# Altium schematic sheet pcb_tutorial.SchDoc: Wacky2023 XXX
size A3; DrawnBy: Heng Yin; Address1: ECE Department; Address2: University of Canterbury; Address3: Christchurch 8041; Address4: New Zealand; Revision: 1; ImagePath: \\maxwell\elecapp\AltiumDesigner\Templates\uc-logo.png
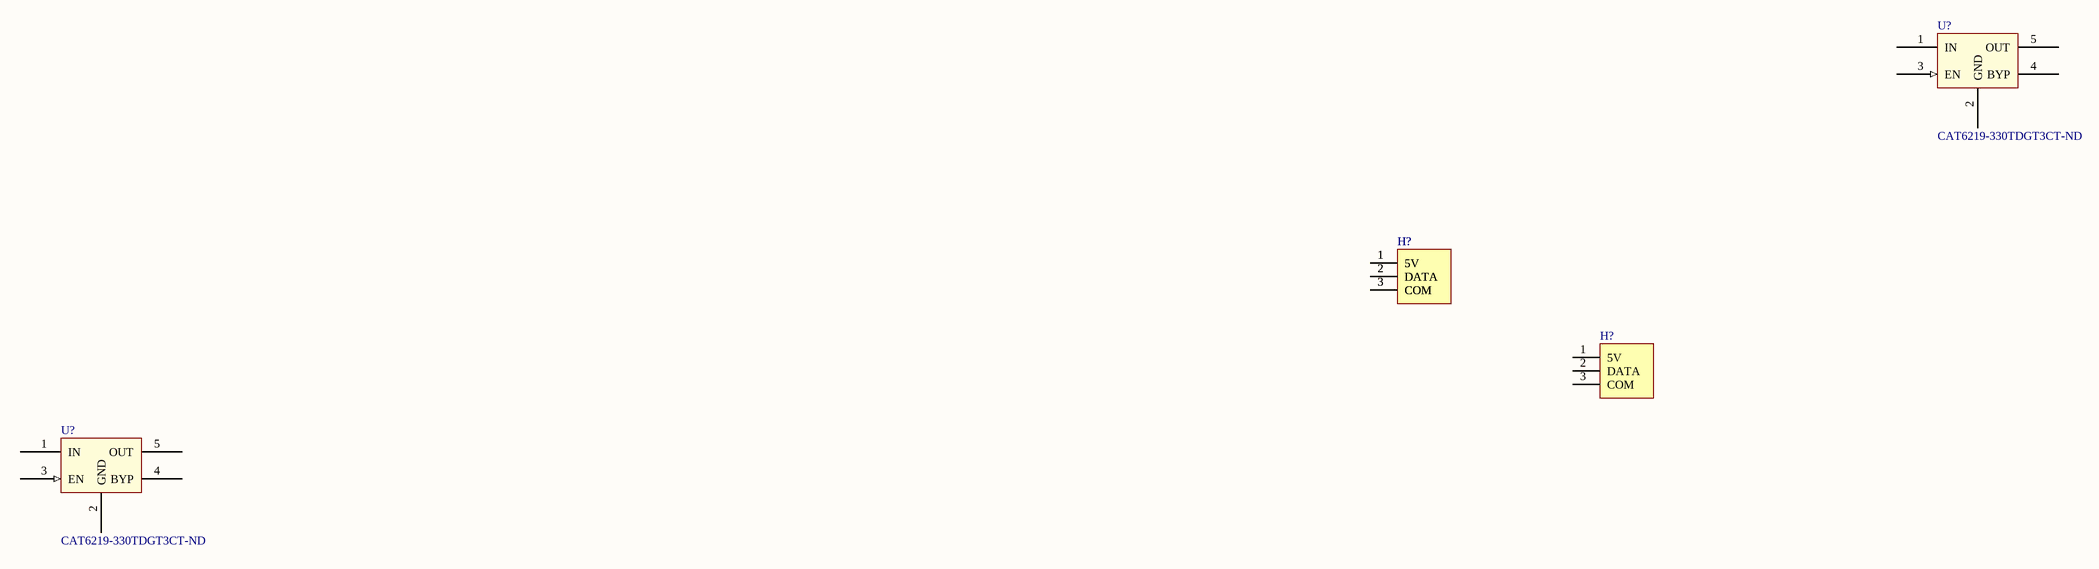
[diagram p0: pcb_tutorial.SchDoc]

## Parts
(Parts that share a designator on the sheet are numbered #1, #2 ... from top to bottom, then left to right.)
H?#1  3 Pin Molex KK Hdr  [MOLEX_KK_3_HDR]  (value not drawn)
H?#2  3 Pin Molex KK Hdr  [MOLEX_KK_3_HDR]  (value not drawn)
H?#3  3 Pin Molex KK Hdr  [MOLEX_KK_3_HDR]  (value not drawn)
U?#1  Supplier Part Number: CAT6219-330TDGT3CT-ND  [SOT95P280X145-5N]  (hidden comment: CAT6219-330TDGT3)
U?#2  Supplier Part Number: CAT6219-330TDGT3CT-ND  [SOT95P280X145-5N]  (hidden comment: CAT6219-330TDGT3)

## Nets
NetH?#1_1: H?#1.1(5V) H?#2.1(5V)
NetH?#1_2: H?#1.2(DATA) H?#2.2(DATA)
NetH?#1_3: H?#1.3(COM) H?#2.3(COM)

Not connected (* = marked no-connect by the designer): H?#3 1(5V) 2(DATA) 3(COM); U?#1 1(IN) 2(GND) 3(EN) 4(BYP) 5(OUT); U?#2 1(IN) 2(GND) 3(EN) 4(BYP) 5(OUT)

## Notes on the sheet
- Title
- Drawn by:
- Date:
- Time:
- Revision:
- Sheet
- of
- File:

## Library data of the parts
H?#1-H?#3 = LED_Strip_Header: CONN HEADER 3POS 2.54mm VERT_Thru Hole; Manufacturer: Molex; Manufacturer PN: 22-23-2031; Supplier Part Number 1: 9731156; Supplier: ECE Dept; Supplier 1: Farnell; Storage Location: ECE Dept Store; Value: 3 Pin Molex KK Hdr
U?#1 U?#2 = SV_CAT6219-330TDGT3: IC REG LIN 3.3V 500MA TSOT23-5; Voltage - Input (Max): 5.5V; Voltage Dropout (Max): 0.5V @ 500mA; Manufacturer Part Number: CAT6219-330TDGT3; Base Part Number: CAT6219; Current - Output: 500mA; Package / Case: SOT-23-5 Thin, TSOT-23-5; Supplier: Digi-Key; Supplier Device Package: TSOT-23-5; Voltage - Output (Min/Fixed): 3.3V; ComponentLink1URL: http://www.onsemi.com/pub/Collateral/CAT6219-D.PDF; ComponentLink1Description: http://www.onsemi.com/pub/Collateral/CAT6219-D.PDF; Supplier 1: Digi-Key; ComponentLink2Description: CAT6219 Datasheet; ComponentLink2URL: \\maxwell\elecapp\AltiumDesigner\Libraries\DatasheetsNew\ENCE461\CAT6219-D.PDF